# Altium project Drone_Powerv2.0.PrjPCB
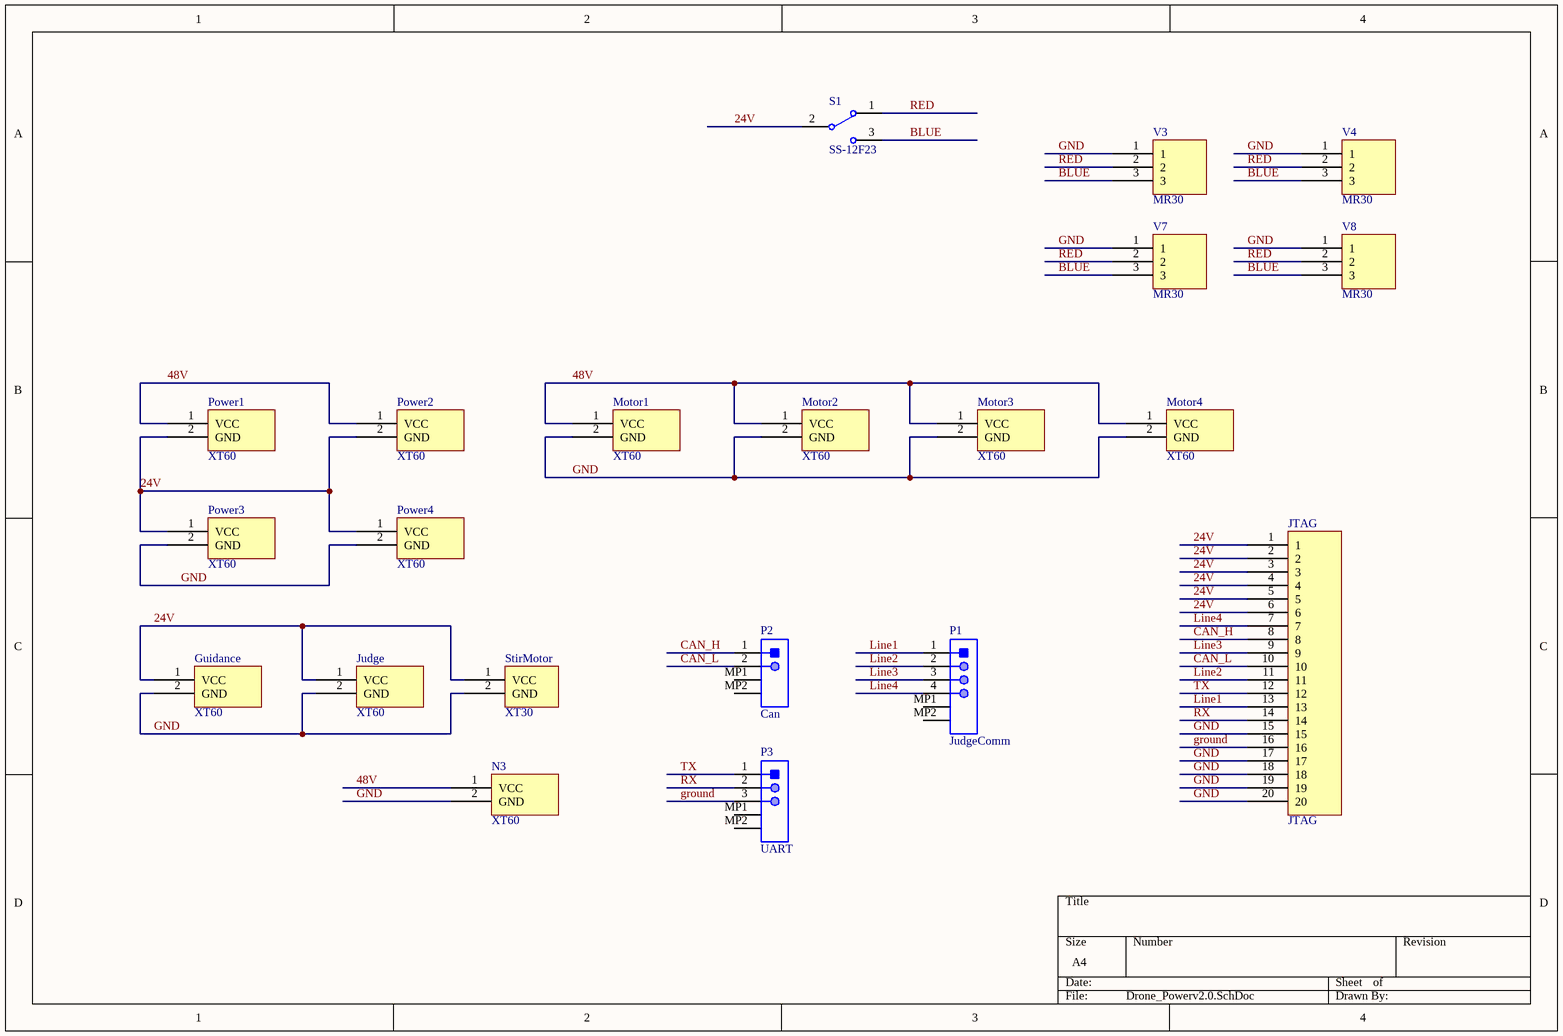
[diagram p0: Drone_Powerv2.0.SchDoc]
1 sheet, 21 parts. Net scope: global (net labels, ports and power ports of the same name join across sheets).
Board file: Drone_Powerv2.0.PcbDoc

## Sheet Drone_Powerv2.0.SchDoc
size A4

### Parts
Guidance  XT60  [TX60UPB-F]
JTAG  JTAG  [IDC20S]
Judge  XT60  [TX60UPB-F]
Motor1  XT60  [TX60UPB-F]
Motor2  XT60  [TX60UPB-F]
Motor3  XT60  [TX60UPB-F]
Motor4  XT60  [TX60UPB-F]
N3  XT60  [TX60UPB-F]
P1  JudgeComm  [JST-BM04B-GHS-TBT_V]
P2  Can  [JST-SM02B-GHS-TB_V]
P3  UART  [JST-BM03B-GHS-TBT_V]
Power1  XT60  [TX60UPB-F]
Power2  XT60  [TX60UPB-F]
Power3  XT60  [TX60PW-F20]
Power4  XT60  [TX60PW-F20]
S1  SS-12F23  [SK-12D07VG3]
StirMotor  XT30  [XT30PW-F30]
V3  MR30  [MR30PB-F]
V4  MR30  [MR30PB-F]
V7  MR30  [MR30PB-F]
V8  MR30  [MR30PB-F]

### Nets
24V: Guidance.1(VCC) JTAG.1 JTAG.2 JTAG.3 JTAG.4 JTAG.5 JTAG.6 Judge.1(VCC) Power1.2(GND) Power2.2(GND) Power3.1(VCC) Power4.1(VCC) S1.2 StirMotor.1(VCC)
48V: Motor1.1(VCC) Motor2.1(VCC) Motor3.1(VCC) Motor4.1(VCC) N3.1(VCC) Power1.1(VCC) Power2.1(VCC)
BLUE: S1.3 V3.3 V4.3 V7.3 V8.3
CAN_H: JTAG.8 P2.1
CAN_L: JTAG.10 P2.2
GND: Guidance.2(GND) JTAG.15 JTAG.17 JTAG.18 JTAG.19 JTAG.20 Judge.2(GND) Motor1.2(GND) Motor2.2(GND) Motor3.2(GND) Motor4.2(GND) N3.2(GND) Power3.2(GND) Power4.2(GND) StirMotor.2(GND) V3.1 V4.1 V7.1 V8.1
ground: JTAG.16 P3.3
Line1: JTAG.13 P1.1
Line2: JTAG.11 P1.2
Line3: JTAG.9 P1.3
Line4: JTAG.7 P1.4
RED: S1.1 V3.2 V4.2 V7.2 V8.2
RX: JTAG.14 P3.2
TX: JTAG.12 P3.1

Not connected (* = marked no-connect by the designer): P1 MP1 MP2; P2 MP1 MP2; P3 MP1 MP2

### Library data of the parts
Guidance Judge Motor1-Motor4 N3 Power1-Power4 = XT60电源插头
P1 = BM04B-GHS-TBT(LF)(SN): GH Disconnectable Crimp Style Connector, Pitch 1.25 mm, 1 x 4 Position, Height 4.05 mm, -25 to 85 degC, RoHS, Tape and Reel; Manufacturer: JST; No of Positions: 5; Pitch: 1.25mm; Style/Orientation: StraightHeader/Plug; Package Reference: BM05B-GHS-TBT; Type: WiretoBoard; Datasheet URL: http://www.jst-mfg.com/product/pdf/eng/eGH.pdf; Termination: Crimp; Manufacturer URL: http://www.jst.com/home2.html; Mounting Technology: SurfaceMount; Datasheet Version: 05/2016; Package Description: GH Disconnectable Crimp Style Connector, Pitch 1.25 mm, 1 x 5 Position, Height 4.05 mm
P2 = SM02B-GHS-TB(LF)(SN): GH Disconnectable Crimp Style Connector, Pitch 1.25 mm, 1 x 2 Position, Height 4.25 mm, -25 to 85 degC, RoHS, Tape and Reel; Manufacturer: JST; No of Positions: 5; Pitch: 1.25mm; Style/Orientation: StraightHeader/Plug; Package Reference: BM05B-GHS-TBT; Type: WiretoBoard; Datasheet URL: http://www.jst-mfg.com/product/pdf/eng/eGH.pdf; Termination: Crimp; Manufacturer URL: http://www.jst.com/home2.html; Mounting Technology: SurfaceMount; Datasheet Version: 05/2016; Package Description: GH Disconnectable Crimp Style Connector, Pitch 1.25 mm, 1 x 5 Position, Height 4.05 mm
P3 = BM03B-GHS-TBT(LF)(SN): GH Disconnectable Crimp Style Connector, Pitch 1.25 mm, 1 x 3 Position, Height 4.05 mm, -25 to 85 degC, RoHS, Tape and Reel; Manufacturer: JST; No of Positions: 5; Pitch: 1.25mm; Style/Orientation: StraightHeader/Plug; Package Reference: BM05B-GHS-TBT; Type: WiretoBoard; Datasheet URL: http://www.jst-mfg.com/product/pdf/eng/eGH.pdf; Termination: Crimp; Manufacturer URL: http://www.jst.com/home2.html; Mounting Technology: SurfaceMount; Datasheet Version: 05/2016; Package Description: GH Disconnectable Crimp Style Connector, Pitch 1.25 mm, 1 x 5 Position, Height 4.05 mm
S1 = SSW-1P: 1路波动开关; BOM名称: 波动开关; 版权归属: 源创客; 学习资源: www.ooocke.com
StirMotor = XT30电源插头
V3 V4 V7 V8 = MR电源插头